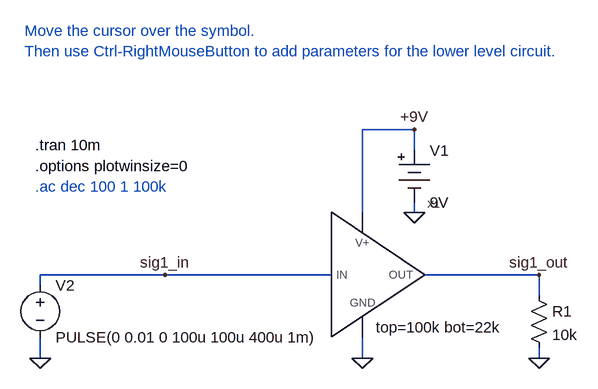
[diagram p0: schematic top_preamp.asc]
top_preamp.asc, the LTspice schematic file:
Version 4
SHEET 1 880 680
WIRE -352 256 -352 240
WIRE -352 368 -352 336
WIRE -160 240 -352 240
WIRE 96 240 -160 240
WIRE 144 144 144 16
WIRE 144 368 144 336
WIRE 224 16 144 16
WIRE 224 48 224 16
WIRE 224 144 224 128
WIRE 416 240 240 240
WIRE 416 272 416 240
WIRE 416 368 416 352
FLAG 144 368 0
FLAG 224 144 0
FLAG 224 16 +9V
FLAG 416 368 0
FLAG -352 368 0
FLAG -160 240 sig1_in
FLAG 416 240 sig1_out
SYMBOL Misc\\battery 224 32 R0
SYMATTR InstName V1
SYMATTR Value 9V
SYMBOL preamp 144 240 R0
WINDOW 39 21 81 Left 0
SYMATTR InstName X1
SYMATTR SpiceLine top=100k bot=22k
SYMBOL res 400 256 R0
SYMATTR InstName R1
SYMATTR Value 10k
SYMBOL voltage -352 240 R0
WINDOW 123 0 0 Left 0
WINDOW 39 0 0 Left 0
SYMATTR InstName V2
SYMATTR Value PULSE(0 0.01 0 100u 100u 400u 1m)
TEXT -360 40 Left 0 !.tran 10m
TEXT -360 72 Left 0 !.options plotwinsize=0
TEXT -360 104 Left 0 ;.ac dec 100 1 100k
TEXT -376 -136 Left 0 ;Move the cursor over the symbol.\nThen use Ctrl-RightMouseButton to add parameters for the lower level circuit.

The netlist it stands for:
* top_preamp.asc
V1 +9V 0 9V
XX1 sig1_in 0 sig1_out +9V preamp params: top=100k bot=22k  ; pins IN GND OUT V+
R1 sig1_out 0 10k
V2 sig1_in 0 PULSE(0 0.01 0 100u 100u 400u 1m)
.tran 10m
.options plotwinsize=0
* .ac dec 100 1 100k
* Move the cursor over the symbol.
* Then use Ctrl-RightMouseButton to add parameters for the lower level circuit.
.backanno
.end